# EAGLE design imu_2_xy (EAGLE 4.15)

## Sheet 1 of 2
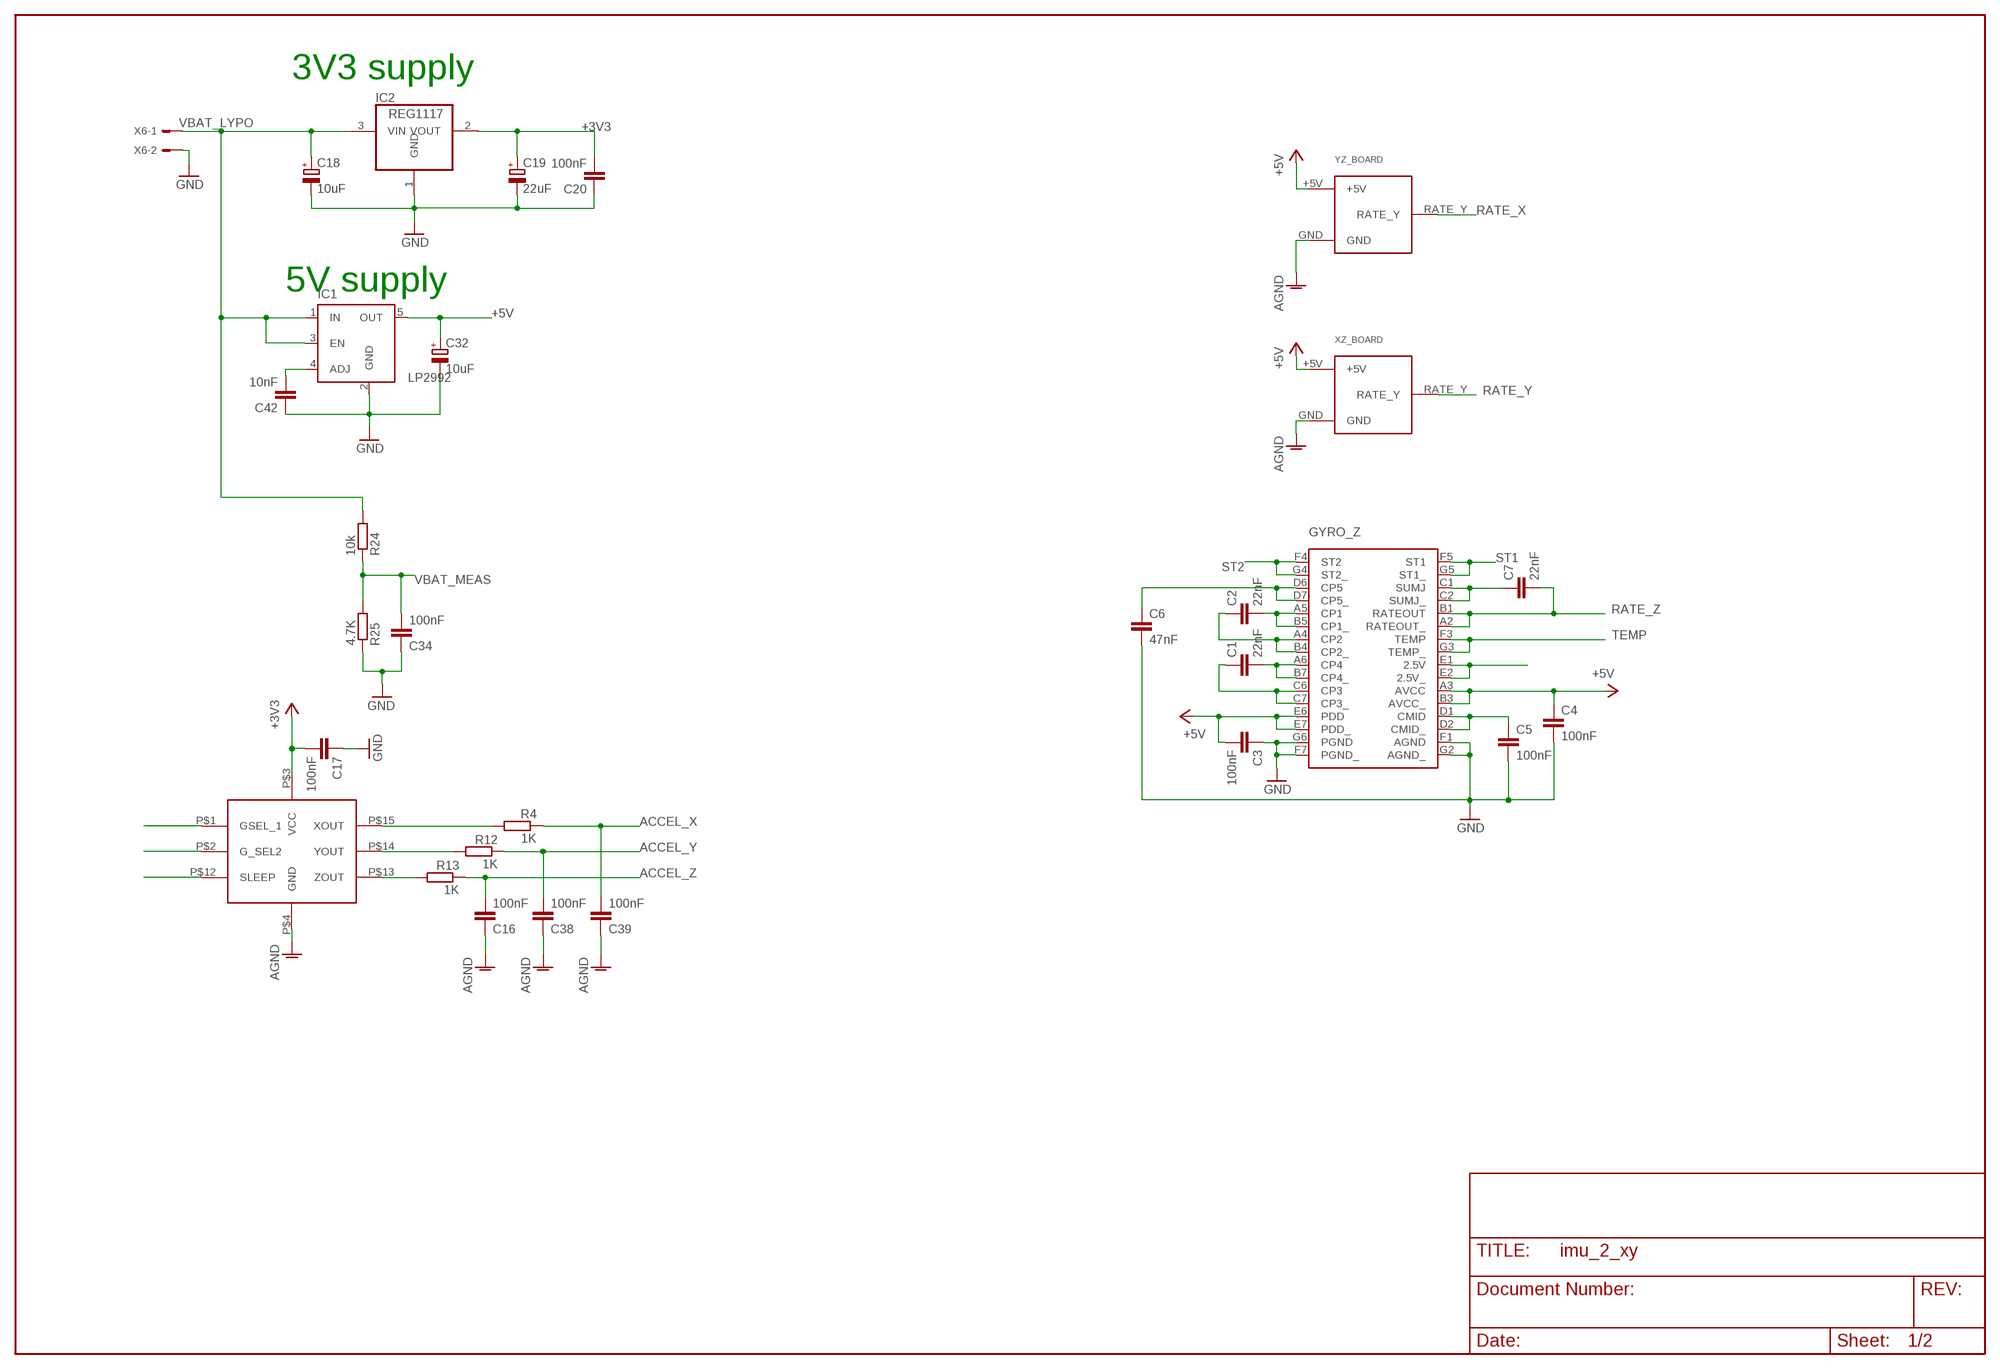
[diagram p0: schematic, sheet 1]

### Parts
C1  22nF  C-EUC0402K  [C0402K]
C2  22nF  C-EUC0402K  [C0402K]
C3  100nF  C-EUC0402K  [C0402K]
C4  100nF  C-EUC0402K  [C0402K]
C5  100nF  C-EUC0402K  [C0402K]
C6  47nF  C-EUC0402K  [C0402K]
C7  22nF  C-EUC0402K  [C0402K]
C16  100nF  C-EUC0402K  [C0402K]
C17  100nF  C-EUC0603K  [C0603K]
C18  10uF  CPOL-EUA/3216-18R  [A/3216-18R]
C19  22uF  CPOL-EUB/3528-21R  [B/3528-21R]
C20  100nF  C-EUC0603K  [C0603K]
C32  10uF  CPOL-EUA/3216-18R  [A/3216-18R]
C34  100nF  C-EUC0603K  [C0603K]
C38  100nF  C-EUC0603K  [C0603K]
C39  100nF  C-EUC0402K  [C0402K]
C42  10nF  C-EUC0603K  [C0603K]
GYRO_Z  ADXR  [BC-32]
IC1  LP2992  MIC5219BM5  [SOT23-5]
IC2  REG1117  [SOT223]
R4  1K  R-EU_R0402  [R0402]
R12  1K  R-EU_R0402  [R0402]
R13  1K  R-EU_R0402  [R0402]
R24  10k  R-EU_R0603  [R0603]
R25  4.7K  R-EU_R0603  [R0603]
U$5  MMA7260  [CASE162201]
X6  53048-02  [53048-02]
XZ_BOARD  IMU_XZ  [IMU_XZ]
YZ_BOARD  IMU_XZ  [IMU_XZ]

### Nets
+3V3: C17.2 C19.+ C20.2 IC2.2(VOUT) U$5.P$3(VCC) ; also sheet 2
+5V: C3.2 C4.1 C32.+ GYRO_Z.A3(AVCC) GYRO_Z.B3(AVCC_) GYRO_Z.E6(PDD) GYRO_Z.E7(PDD_) IC1.5(OUT) XZ_BOARD.+5V YZ_BOARD.+5V ; also sheet 2
ACCEL_X: C39.2 R4.1 ; also sheet 2
ACCEL_Y: C38.2 R12.1 ; also sheet 2
ACCEL_Z: C16.2 R13.1 ; also sheet 2
AGND: C16.1 C38.1 C39.1 U$5.P$4(GND) XZ_BOARD.GND YZ_BOARD.GND ; also sheet 2
GND: C3.1 C4.2 C5.2 C6.2 C17.1 C18.- C19.- C20.1 C32.- C34.1 C42.1 GYRO_Z.F1(AGND) GYRO_Z.F7(PGND_) GYRO_Z.G2(AGND_) GYRO_Z.G6(PGND) IC1.2(GND) IC2.1(GND) R25.1 X6.2 ; also sheet 2
N$1: C1.2 GYRO_Z.A6(CP4) GYRO_Z.B7(CP4_)
N$2: C1.1 GYRO_Z.C6(CP3) GYRO_Z.C7(CP3_)
N$3: C2.2 GYRO_Z.A5(CP1) GYRO_Z.B5(CP1_)
N$4: C2.1 GYRO_Z.A4(CP2) GYRO_Z.B4(CP2_)
N$5: GYRO_Z.E1(2.5V) GYRO_Z.E2(2.5V_)
N$6: R4.2 U$5.P$15(XOUT)
N$8: C7.1 GYRO_Z.C1(SUMJ) GYRO_Z.C2(SUMJ_)
N$9: C6.1 GYRO_Z.D6(CP5) GYRO_Z.D7(CP5_)
N$10: C5.1 GYRO_Z.D1(CMID) GYRO_Z.D2(CMID_)
N$11: R12.2 U$5.P$14(YOUT)
N$12: R13.2 U$5.P$13(ZOUT)
N$13: U$5.P$1(GSEL_1)
N$16: U$5.P$2(G_SEL2)
N$17: U$5.P$12(SLEEP)
N$23: C42.2 IC1.4(ADJ)
RATE_X: YZ_BOARD.RATE_Y ; also sheet 2
RATE_Y: XZ_BOARD.RATE_Y ; also sheet 2
RATE_Z: C7.2 GYRO_Z.A2(RATEOUT_) GYRO_Z.B1(RATEOUT) ; also sheet 2
ST1: GYRO_Z.F5(ST1) GYRO_Z.G5(ST1_)
ST2: GYRO_Z.F4(ST2) GYRO_Z.G4(ST2_)
TEMP: GYRO_Z.F3(TEMP) GYRO_Z.G3(TEMP_) ; also sheet 2
VBAT_LYPO: C18.+ IC1.1(IN) IC1.3(EN) IC2.3(VIN) R24.2 X6.1
VBAT_MEAS: C34.2 R24.1 R25.2

### Notes on the sheet
- 3V3 supply
- 5V supply

## Sheet 2 of 2
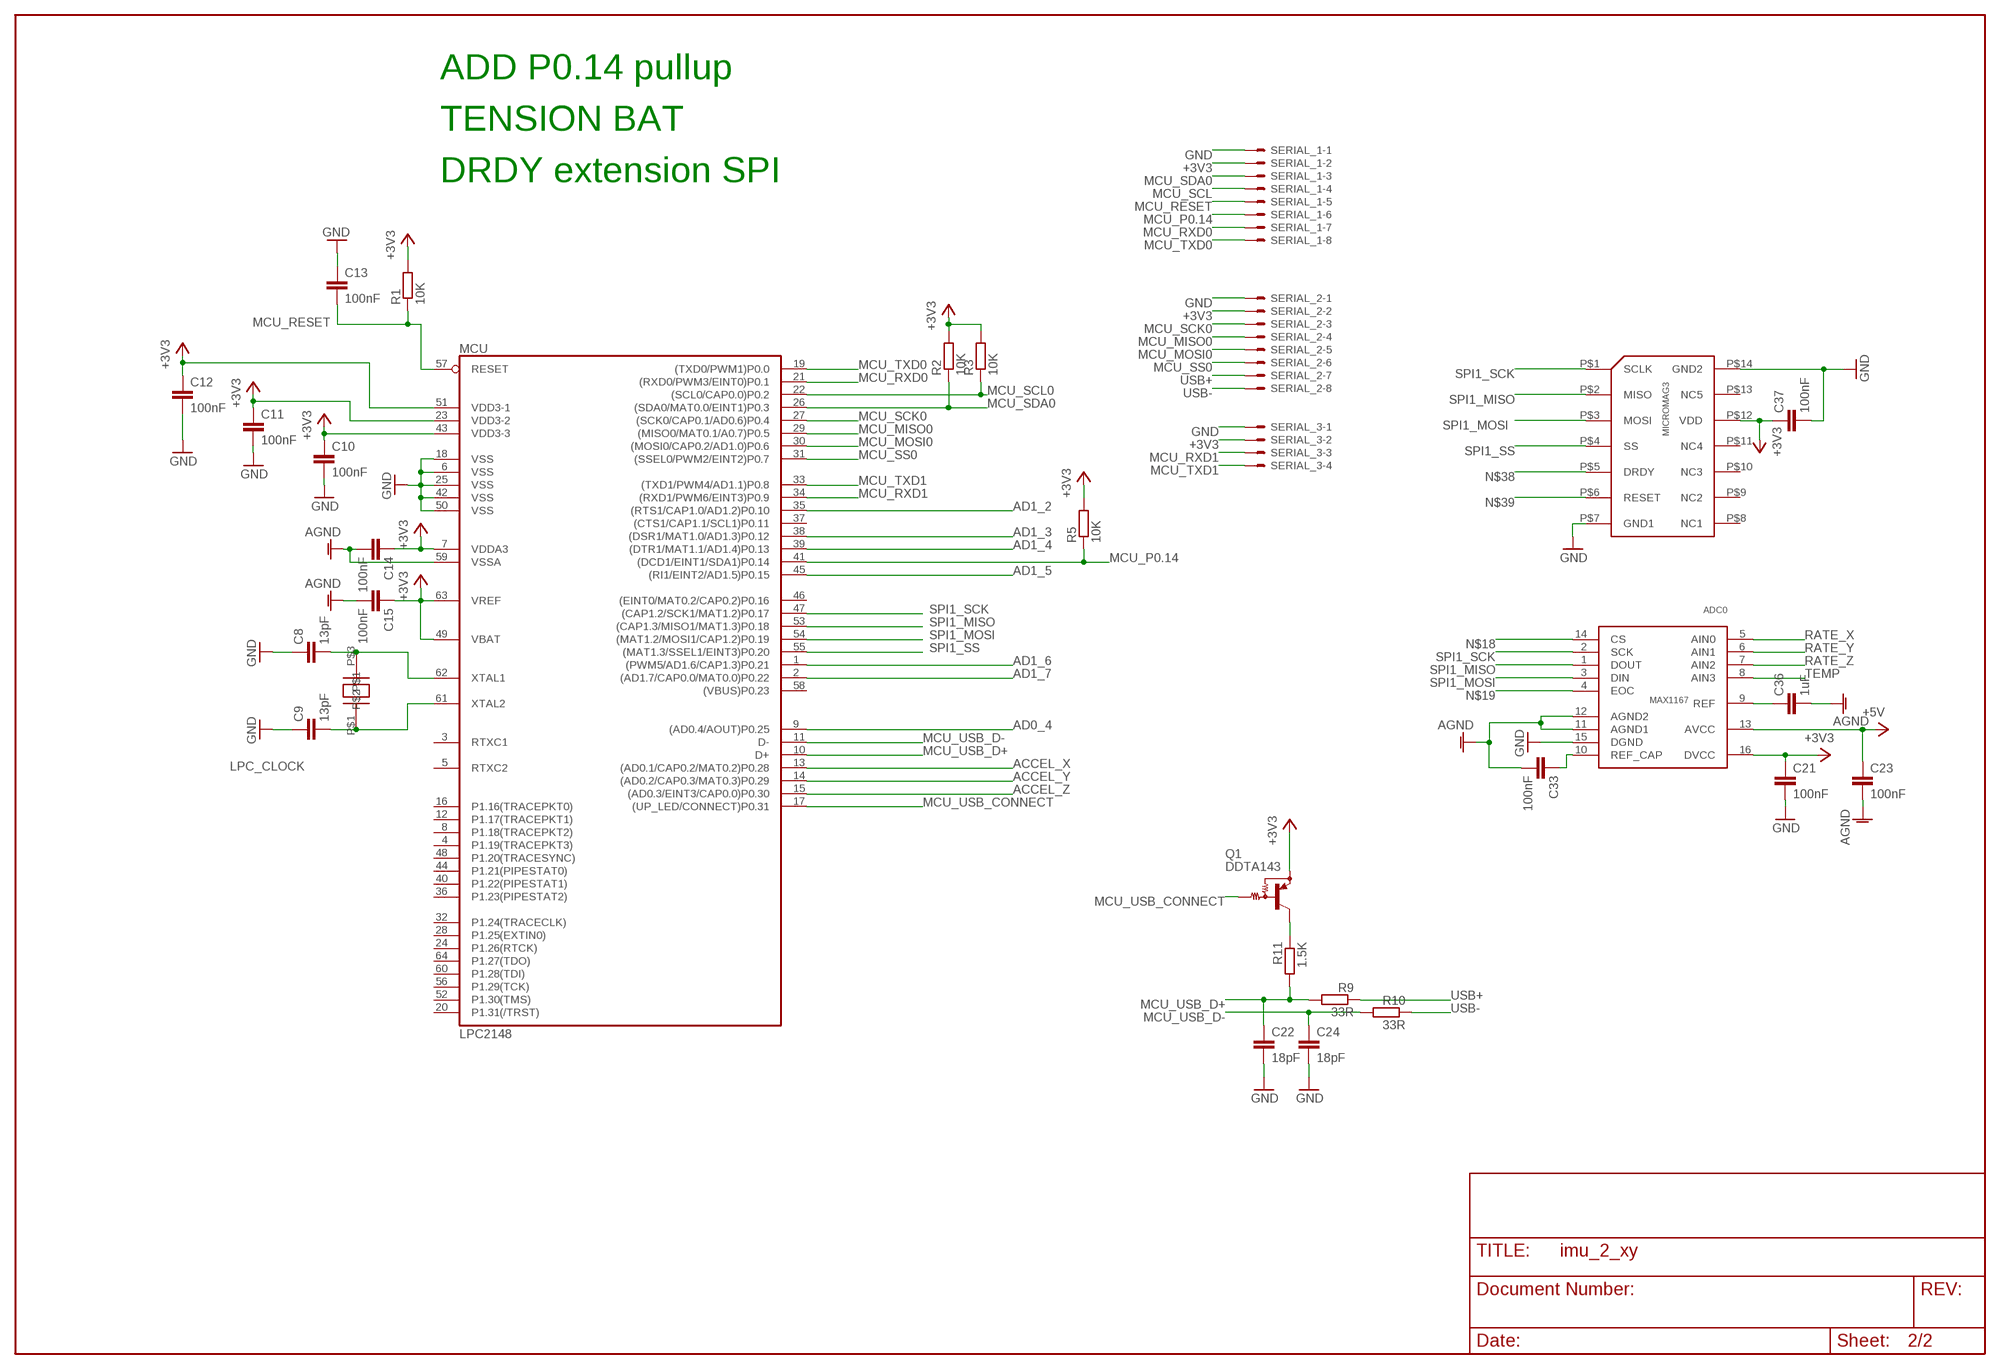
[diagram p1: schematic, sheet 2]

### Parts
ADC0  MAX1167  [QSOP16]
C8  13pF  C-EUC0402K  [C0402K]
C9  13pF  C-EUC0402K  [C0402K]
C10  100nF  C-EUC0402K  [C0402K]
C11  100nF  C-EUC0402K  [C0402K]
C12  100nF  C-EUC0402K  [C0402K]
C13  100nF  C-EUC0402K  [C0402K]
C14  100nF  C-EUC0402K  [C0402K]
C15  100nF  C-EUC0402K  [C0402K]
C21  100nF  C-EUC0402K  [C0402K]
C22  18pF  C-EUC0402K  [C0402K]
C23  100nF  C-EUC0402K  [C0402K]
C24  18pF  C-EUC0402K  [C0402K]
C33  100nF  C-EUC0402K  [C0402K]
C36  1uF  C-EUC0805  [C0805]
C37  100nF  C-EUC0402K  [C0402K]
MCU  LPC2148  [SQFP-S-10X10-64]
Q1  DDTA143  MUN2111T1  [SC59-BEC]
R1  10K  R-EU_R0402  [R0402]
R2  10K  R-EU_R0402  [R0402]
R3  10K  R-EU_R0402  [R0402]
R5  10K  R-EU_R0402  [R0402]
R9  33R  R-EU_R1005  [R1005]
R10  33R  R-EU_R1005  [R1005]
R11  1.5K  R-EU_R1005  [R1005]
SERIAL_1  53047-08  [53047-08]
SERIAL_2  53047-08  [53047-08]
SERIAL_3  53047-04  [53047-04]
U$3  14.764Mhz  CRYSTAL_CTS  [CTS_CRYSTAL]
U$9  MICROMAG3  [MICROMAG3]

### Nets
+3V3: ADC0.16(DVCC) C10.1 C11.1 C12.1 C14.1 C15.1 C21.1 C37.1 MCU.7(VDDA3) MCU.23(VDD3-2) MCU.43(VDD3-3) MCU.49(VBAT) MCU.51(VDD3-1) MCU.63(VREF) Q1.E R1.2 R2.2 R3.2 R5.2 SERIAL_1.2 SERIAL_2.2 SERIAL_3.2 U$9.P$12(VDD) ; also sheet 1
+5V: ADC0.13(AVCC) C23.1 ; also sheet 1
ACCEL_X: MCU.13((AD0.1/CAP0.2/MAT0.2)P0.28) ; also sheet 1
ACCEL_Y: MCU.14((AD0.2/CAP0.3/MAT0.3)P0.29) ; also sheet 1
ACCEL_Z: MCU.15((AD0.3/EINT3/CAP0.0)P0.30) ; also sheet 1
AD0_4: MCU.9((AD0.4/AOUT)P0.25)
AD1_2: MCU.35((RTS1/CAP1.0/AD1.2)P0.10)
AD1_3: MCU.38((DSR1/MAT1.0/AD1.3)P0.12)
AD1_4: MCU.39((DTR1/MAT1.1/AD1.4)P0.13)
AD1_5: MCU.45((RI1/EINT2/AD1.5)P0.15)
AD1_6: MCU.1((PWM5/AD1.6/CAP1.3)P0.21)
AD1_7: MCU.2((AD1.7/CAP0.0/MAT0.0)P0.22)
AGND: ADC0.11(AGND1) ADC0.12(AGND2) C14.2 C15.2 C23.2 C33.2 C36.2 MCU.59(VSSA) ; also sheet 1
GND: ADC0.15(DGND) C8.1 C9.1 C10.2 C11.2 C12.2 C13.1 C21.2 C22.2 C24.2 C37.2 MCU.6(VSS) MCU.18(VSS) MCU.25(VSS) MCU.42(VSS) MCU.50(VSS) SERIAL_1.1 SERIAL_2.1 SERIAL_3.1 U$9.P$7(GND1) U$9.P$14(GND2) ; also sheet 1
LPC_CLOCK: C9.2 MCU.61(XTAL2) U$3.P$1
MCU_MISO0: MCU.29((MISO0/MAT0.1/A0.7)P0.5) SERIAL_2.4
MCU_MOSI0: MCU.30((MOSI0/CAP0.2/AD1.0)P0.6) SERIAL_2.5
MCU_P0.14: MCU.41((DCD1/EINT1/SDA1)P0.14) R5.1 SERIAL_1.6
MCU_RESET: C13.2 MCU.57(RESET) R1.1 SERIAL_1.5
MCU_RXD0: MCU.21((RXD0/PWM3/EINT0)P0.1) SERIAL_1.7
MCU_RXD1: MCU.34((RXD1/PWM6/EINT3)P0.9) SERIAL_3.3
MCU_SCK0: MCU.27((SCK0/CAP0.1/AD0.6)P0.4) SERIAL_2.3
MCU_SCL: SERIAL_1.4
MCU_SCL0: MCU.22((SCL0/CAP0.0)P0.2) R3.1
MCU_SDA0: MCU.26((SDA0/MAT0.0/EINT1)P0.3) R2.1 SERIAL_1.3
MCU_SS0: MCU.31((SSEL0/PWM2/EINT2)P0.7) SERIAL_2.6
MCU_TXD0: MCU.19((TXD0/PWM1)P0.0) SERIAL_1.8
MCU_TXD1: MCU.33((TXD1/PWM4/AD1.1)P0.8) SERIAL_3.4
MCU_USB_CONNECT: MCU.17((UP_LED/CONNECT)P0.31) Q1.B
MCU_USB_D+: C22.1 MCU.10(D+) R9.2 R11.2
MCU_USB_D-: C24.1 MCU.11(D-) R10.2
N$7: C8.2 MCU.62(XTAL1) U$3.P$3
N$14: Q1.C R11.1
N$18: ADC0.14(CS)
N$19: ADC0.4(EOC)
N$20: ADC0.10(REF_CAP) C33.1
N$21: ADC0.9(REF) C36.1
N$38: U$9.P$5(DRDY)
N$39: U$9.P$6(RESET)
RATE_X: ADC0.5(AIN0) ; also sheet 1
RATE_Y: ADC0.6(AIN1) ; also sheet 1
RATE_Z: ADC0.7(AIN2) ; also sheet 1
SPI1_MISO: ADC0.1(DOUT) MCU.53((CAP1.3/MISO1/MAT1.3)P0.18) U$9.P$2(MISO)
SPI1_MOSI: ADC0.3(DIN) MCU.54((MAT1.2/MOSI1/CAP1.2)P0.19) U$9.P$3(MOSI)
SPI1_SCK: ADC0.2(SCK) MCU.47((CAP1.2/SCK1/MAT1.2)P0.17) U$9.P$1(SCLK)
SPI1_SS: MCU.55((MAT1.3/SSEL1/EINT3)P0.20) U$9.P$4(SS)
TEMP: ADC0.8(AIN3) ; also sheet 1
USB+: R9.1 SERIAL_2.7
USB-: R10.1 SERIAL_2.8
Unconnected: MCU.3(RTXC1) MCU.4(P1.19(TRACEPKT3)) MCU.5(RTXC2) MCU.8(P1.18(TRACEPKT2)) MCU.12(P1.17(TRACEPKT1)) MCU.16(P1.16(TRACEPKT0)) MCU.20(P1.31(/TRST)) MCU.24(P1.26(RTCK)) MCU.28(P1.25(EXTIN0)) MCU.32(P1.24(TRACECLK)) MCU.36(P1.23(PIPESTAT2)) MCU.37((CTS1/CAP1.1/SCL1)P0.11) MCU.40(P1.22(PIPESTAT1)) MCU.44(P1.21(PIPESTAT0)) MCU.46((EINT0/MAT0.2/CAP0.2)P0.16) MCU.48(P1.20(TRACESYNC)) MCU.52(P1.30(TMS)) MCU.56(P1.29(TCK)) MCU.58((VBUS)P0.23) MCU.60(P1.28(TDI)) MCU.64(P1.27(TDO)) U$9.P$8(NC1) U$9.P$9(NC2) U$9.P$10(NC3) U$9.P$11(NC4) U$9.P$13(NC5)

### Notes on the sheet
- ADD P0.14 pullup
- TENSION BAT
- DRDY extension SPI

## Library data of the parts
ADC0 = paparazzi:MAX1167: 16 bits 4 channel ADC
C1-C17 C20-C24 C33 C34 C36-C39 C42 = rcl:C-EU: CAPACITOR, European symbol
C18 C19 C32 = rcl:CPOL-EU: POLARIZED CAPACITOR, European symbol
GYRO_Z = paparazzi:ADXR
IC1 = v-reg-micrel:MIC5219BM5: VOLTAGE REGULATOR
IC2 = burr-brown:REG1117: 800mA and 1A Low Dropout (LDO) Positive Regulator 1.8V, 2.5V, 2.85V, 3.3V, 5V, and Adj
MCU = paparazzi:LPC2148
Q1 = transistor-pnp:MUN2111*: PNP Bias Resistor Transistor
R1-R5 R9-R13 R24 R25 = rcl:R-EU_: RESISTOR, European symbol
SERIAL_1 SERIAL_2 = con-molex:53?-08: CONNECTOR wire to board 1.25 mm (.049 inch) pitch header
SERIAL_3 = con-molex:53?-04: CONNECTOR wire to board 1.25 mm (.049 inch) pitch header
U$3 = paparazzi:CRYSTAL_CTS
U$5 = paparazzi:MMA7260
U$9 = paparazzi:MICROMAG3
X6 = con-molex:53?-02: CONNECTOR wire to board 1.25 mm (.049 inch) pitch header
XZ_BOARD YZ_BOARD = paparazzi:IMU_XZ

## Board
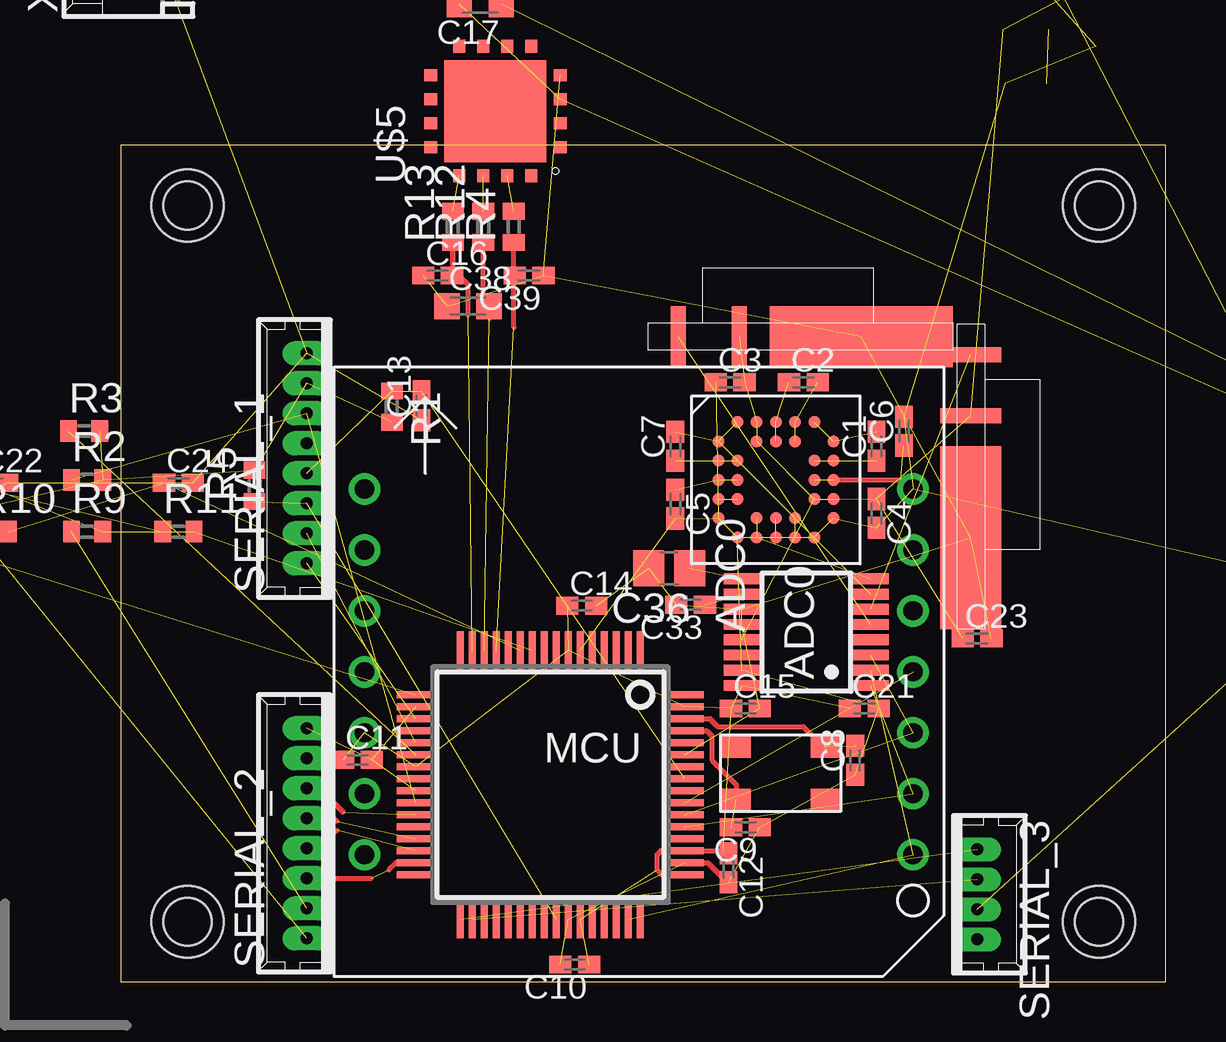
[diagram p2: board, top side]
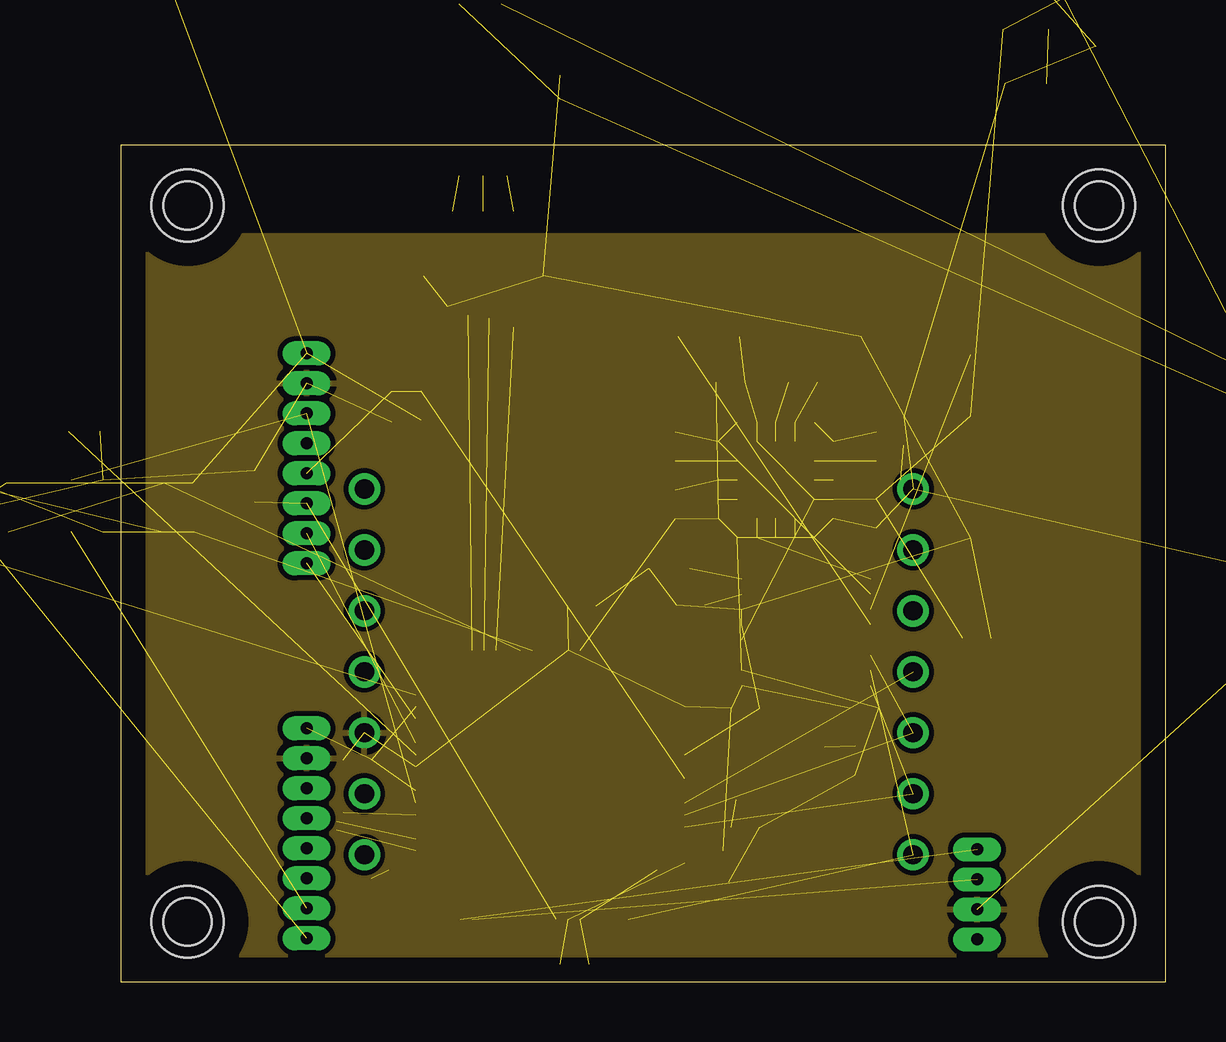
[diagram p3: board, inner layer $Route2]
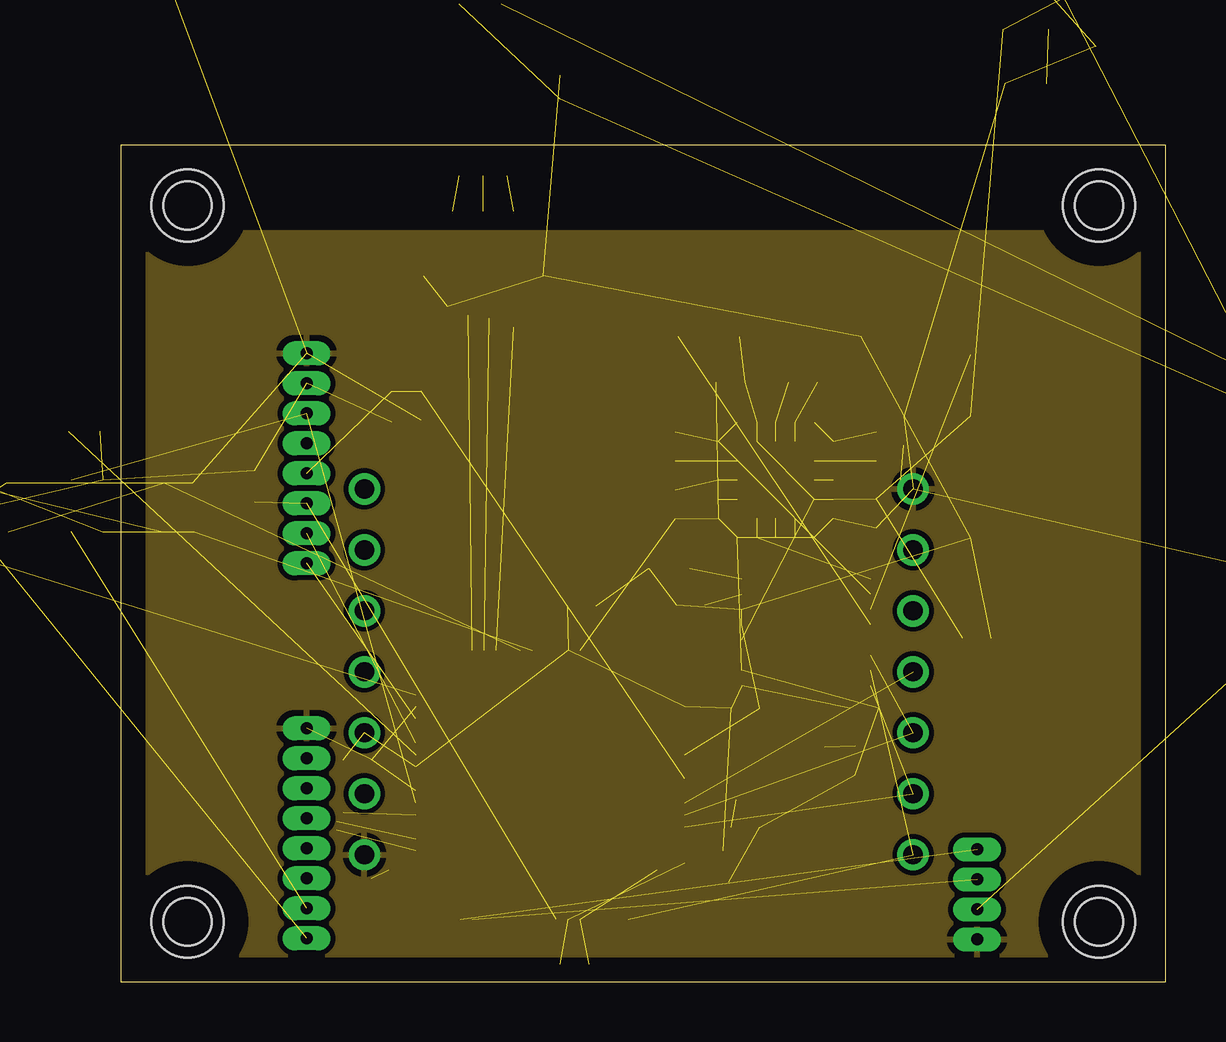
[diagram p4: board, inner layer $Route15]
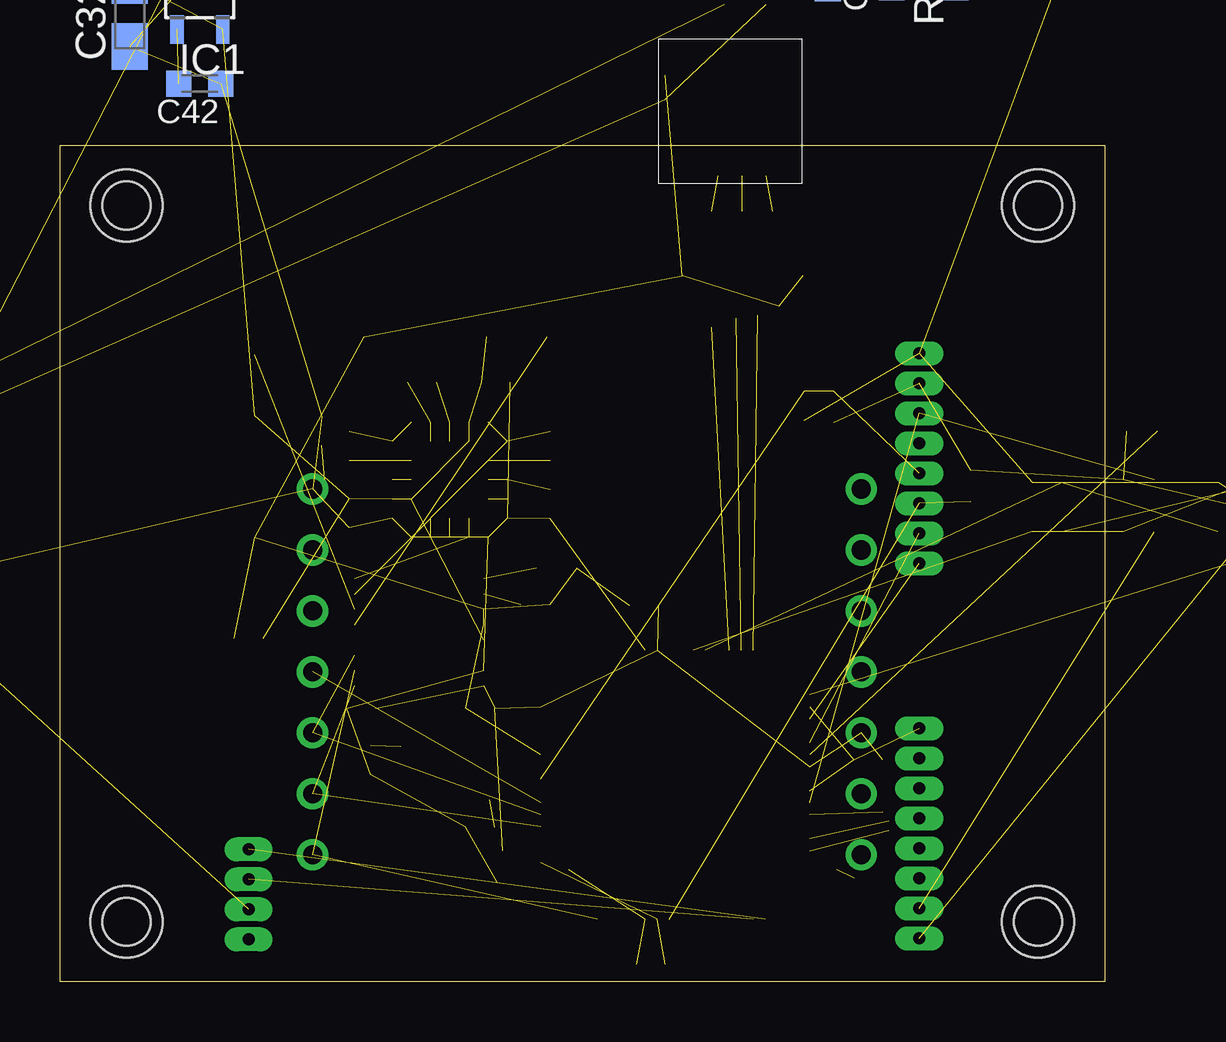
[diagram p5: board, bottom side, seen from below]

Size 43.54 x 34.85 mm. Coordinates in mm from the lower left corner, seen from the top.
Outline: 0,0 43.54,0 43.54,34.85 0,34.85 0,0
Copper layers (1*16): Top 0.035mm / dielectric 1.5mm / Bottom 0.035mm
Design rules "eurocircuits_europrint": minimum track width 0.2mm, minimum drill 0.35mm, track to track 0.2mm, track to pad 0.2mm, pad to pad 0.2mm, via to via 0.2mm, smd to smd 0.2mm, copper to edge 40mil, drill to drill 8mil, minimum pad ring 10mil, minimum via ring 5mil, stop-mask expansion 4mil, vias tented up to drill 0mil, thermal gap 10mil
Holes 2 mm at 40.76,32.35 40.76,2.5 2.79,32.35 2.79,2.5
Holes 3 mm at 2.79,32.35 2.79,2.5 40.76,32.35 40.76,2.5

### Footprints (pad centres in the part's own frame; a part is rotated, then mirrored left to right if it is on the bottom)
QSOP16 = smd 0.45 x 1.5: 1 -2.223,-2.69; 2 -1.587,-2.69; 3 -0.953,-2.69; 4 -0.318,-2.69; 5 0.318,-2.69; 6 0.953,-2.69; 7 1.587,-2.69; 8 2.223,-2.69; 9 2.223,2.69; 10 1.587,2.69; 11 0.953,2.69; 12 0.318,2.69; 13 -0.318,2.69; 14 -0.953,2.69; 15 -1.587,2.69; 16 -2.223,2.69
C0402K = smd 0.925 x 0.74: 1 -0.6,0; 2 0.6,0
C0603K = smd 1.05 x 1.08: 1 -0.875,0; 2 0.875,0
A/3216-18R = smd 1.95 x 1.5: + 1.375,0; - -1.375,0
B/3528-21R = smd 1.95 x 2.5: + 1.525,0; - -1.525,0
C0805 = smd 1.3 x 1.5: 1 -0.85,0; 2 0.85,0
BC-32 = smd 0.5 x 0.5: A2 -1.6,2.4; A3 -0.8,2.4; A4 0,2.4; A5 0.8,2.4; A6 1.6,2.4; B1 -2.4,1.6; B3 -0.8,1.6; B4 0,1.6; B5 0.8,1.6; B7 2.4,1.6; C1 -2.4,0.8; C2 -1.6,0.8; C6 1.6,0.8; C7 2.4,0.8; D1 -2.4,0; D2 -1.6,0; D6 1.6,0; D7 2.4,0; E1 -2.4,-0.8; E2 -1.6,-0.8; E6 1.6,-0.8; E7 2.4,-0.8; F1 -2.4,-1.6; F3 -0.8,-1.6; F4 0,-1.6; F5 0.8,-1.6; F7 2.4,-1.6; G2 -1.6,-2.4; G3 -0.8,-2.4; G4 0,-2.4; G5 0.8,-2.4; G6 1.6,-2.4
SOT23-5 = smd 0.55 x 1.2: 1 -0.95,-1.3; 2 0,-1.3; 3 0.95,-1.3; 4 0.95,1.3; 5 -0.95,1.3
SOT223 = smd 1.499 x 2.007: 1 -2.261,-3.15; 2 0.025,-3.15; 3 2.311,-3.15 | smd 3.81 x 2.007: 4 0,3.15
SQFP-S-10X10-64 = smd 0.3 x 1.6: 1 -3.75,-5.6; 2 -3.25,-5.6; 3 -2.75,-5.6; 4 -2.25,-5.6; 5 -1.75,-5.6; 6 -1.25,-5.6; 7 -0.75,-5.6; 8 -0.25,-5.6; 9 0.25,-5.6; 10 0.75,-5.6; 11 1.25,-5.6; 12 1.75,-5.6; 13 2.25,-5.6; 14 2.75,-5.6; 15 3.25,-5.6; 16 3.75,-5.6; 33 3.75,5.6; 34 3.25,5.6; 35 2.75,5.6; 36 2.25,5.6; 37 1.75,5.6; 38 1.25,5.6; 39 0.75,5.6; 40 0.25,5.6; 41 -0.25,5.6; 42 -0.75,5.6; 43 -1.25,5.6; 44 -1.75,5.6; 45 -2.25,5.6; 46 -2.75,5.6; 47 -3.25,5.6; 48 -3.75,5.6 | smd 1.6 x 0.3: 17 5.6,-3.75; 18 5.6,-3.25; 19 5.6,-2.75; 20 5.6,-2.25; 21 5.6,-1.75; 22 5.6,-1.25; 23 5.6,-0.75; 24 5.6,-0.25; 25 5.6,0.25; 26 5.6,0.75; 27 5.6,1.25; 28 5.6,1.75; 29 5.6,2.25; 30 5.6,2.75; 31 5.6,3.25; 32 5.6,3.75; 49 -5.6,3.75; 50 -5.6,3.25; 51 -5.6,2.75; 52 -5.6,2.25; 53 -5.6,1.75; 54 -5.6,1.25; 55 -5.6,0.75; 56 -5.6,0.25; 57 -5.6,-0.25; 58 -5.6,-0.75; 59 -5.6,-1.25; 60 -5.6,-1.75; 61 -5.6,-2.25; 62 -5.6,-2.75; 63 -5.6,-3.25; 64 -5.6,-3.75
SC59-BEC = smd 1 x 1.4: B -0.95,-1.2; C 0,1.2; E 0.95,-1.2
R0402 = smd 0.7 x 0.9: 1 -0.65,0; 2 0.65,0
R1005 = smd 0.7 x 0.9: 1 -0.65,0; 2 0.65,0
R0603 = smd 1 x 1.1: 1 -0.85,0; 2 0.85,0
53047-08 = drill 0.5 pad 0.698 long: 1 4.375,0; 2 3.125,0; 3 1.875,0; 4 0.625,0; 5 -0.625,0; 6 -1.875,0; 7 -3.125,0; 8 -4.375,0
53047-04 = drill 0.5 pad 0.698 long: 1 1.875,0; 2 0.625,0; 3 -0.625,0; 4 -1.875,0
CTS_CRYSTAL = smd 1.2 x 0.9: P$1 -1.85,-1.1; P$2 1.85,-1.1; P$3 1.85,1.1; P$4 -1.85,1.1
CASE162201 = smd 0.5 x 0.55: P$1 -1.5,-2.7; P$2 -0.5,-2.7; P$3 0.5,-2.7; P$4 1.5,-2.7; P$9 1.5,2.7; P$10 0.5,2.7; P$11 -0.5,2.7; P$12 -1.5,2.7 | smd 0.55 x 0.5: P$5 2.7,-1.5; P$6 2.7,-0.5; P$7 2.7,0.5; P$8 2.7,1.5; P$13 -2.7,1.5; P$14 -2.7,0.5; P$15 -2.7,-0.5; P$16 -2.7,-1.5 | smd 4.25 x 4.25: P$17 0,0
MICROMAG3 = drill 0.8 round: P$1 -7.62,-11.43; P$2 -5.08,-11.43; P$3 -2.54,-11.43; P$4 0,-11.43; P$5 2.54,-11.43; P$6 5.08,-11.43; P$7 7.62,-11.43; P$8 7.62,11.43; P$9 5.08,11.43; P$10 2.54,11.43; P$11 0,11.43; P$12 -2.54,11.43; P$13 -5.08,11.43; P$14 -7.62,11.43
53048-02 = drill 0.5 pad 0.698 long: 1 0.625,-1.25; 2 -0.625,-1.25
IMU_XZ = smd 0.635 x 2.54: +5V -2.54,0; RATE_Y -5.08,0 | smd 7.62 x 2.54: GND 2.54,0

### Placement (x,y rotation side)
ADC0  28.57,14.57 90 top
C1  31.49,22.31 90 top
C2  28.44,24.98 0 top
C3  25.39,24.98 0 top
C4  31.49,19.52 270 top
C5  23.11,19.9 270 top
C6  32.63,22.95 90 top
C7  23.11,22.31 90 top
C8  30.6,9.23 90 top
C9  26.03,6.44 180 top
C10  18.92,0.72 180 top
C11  9.86,9.25 0 top
C12  25.33,4.75 270 top
C13  12.53,24 90 top
C14  19.21,15.67 0 top
C15  26.03,11.39 0 top
C16  13.2,29.43 0 top
C17  14.98,40.73 180 top  (outside the outline)
C18  47.75,18.5 90 bottom  (outside the outline)
C19  51.68,19.27 0 bottom  (outside the outline)
C20  51.68,16.73 0 bottom  (outside the outline)
C21  30.98,11.39 0 top
C22  -5.34,20.79 0 top  (outside the outline)
C23  35.68,14.31 0 top
C24  2.41,20.79 0 top
C32  40.63,40.35 90 bottom  (outside the outline)
C33  23.74,15.71 180 top
C34  11.55,42.25 270 bottom  (outside the outline)
C36  22.86,17.23 180 top
C37  -10.16,16.85 180 top  (outside the outline)
C38  14.47,28.16 0 top
C39  17.01,29.43 180 top
C42  37.71,37.43 180 bottom
GYRO_Z  27.3,20.92 0 top
IC1  37.71,40.98 180 bottom  (outside the outline)
IC2  51.3,25.36 0 bottom  (outside the outline)
MCU  17.9,8.22 180 top
Q1  -9.53,20.28 0 top  (outside the outline)
R1  11.3,23.96 270 top
R2  -1.4,20.92 0 top
R3  -1.53,22.95 0 top
R4  16.38,31.46 90 top
R5  5.58,20.66 90 top
R9  -1.4,18.76 0 top
R10  -5.34,18.76 0 top  (outside the outline)
R11  2.41,18.76 0 top
R12  15.11,31.46 90 top
R13  13.84,31.46 90 top
R24  6.22,42.25 90 bottom  (outside the outline)
R25  8.89,42.25 270 bottom  (outside the outline)
SERIAL_1  7.74,21.81 90 top
SERIAL_2  7.74,6.18 90 top
SERIAL_3  35.68,3.64 270 top
U$3  27.49,8.69 0 top
U$5  15.62,36.28 90 top
U$9  21.58,12.92 90 top
X6  0.76,42.25 90 top  (outside the outline)
XZ_BOARD  35.43,21.04 270 top
YZ_BOARD  28.32,26.89 0 top

### Tracks (layer width: path | path; a pad name or v marks a point on that pad's centre or on a via)
+3V3  (22 unrouted)
  Top 0.203: MCU.49 22.54,4.47 22.35,4.66 22.35,5.3 22.52,5.47 MCU.51 25.1,5.47 25.27,5.3 C12.1
  pour $Route2: 51.3,31.08 0.25,31.08 0.25,0.34 51.3,0.34
+5V  (11 unrouted)
ACCEL_X  (1 unrouted)
  Top 0.203: 16.38,29.43 R4.1 | 16.38,29.43 C39.2 | 16.38,27.27 16.38,29.43
ACCEL_Y  (1 unrouted)
  Top 0.203: R12.1 15.11,28.66 15.36,28.41 | C38.2 15.36,28.41 | 15.36,28.41 15.36,27.65
ACCEL_Z  (1 unrouted)
  Top 0.203: C16.2 13.84,29.43 R13.1 13.84,29.68 14.47,29.04 14.47,27.77
AGND  (13 unrouted)
GND  (34 unrouted)
  Top 0.203: C12.2 25.27,4.15 24.45,4.97 MCU.50
  pour $Route15: 51.3,31.2 0.25,31.2 0.25,0.34 51.3,0.34
LPC_CLOCK  (1 unrouted)
  Top 0.203: MCU.61 24.42,10.47 24.63,10.25 24.63,9.23 25.65,8.22 U$3.P$1
MCU_MISO0  (1 unrouted)
  Top 0.203: 9.01,6.69 8.89,6.82 SERIAL_2.4
MCU_MOSI0  (1 unrouted)
  Top 0.203: SERIAL_2.5 8.24,5.56 8.25,5.55 9.01,6.31
MCU_P0.14  (2 unrouted)
MCU_RESET  (3 unrouted)
MCU_RXD0  (1 unrouted)
MCU_RXD1  (1 unrouted)
MCU_SCK0  (1 unrouted)
  Top 0.203: SERIAL_2.3 8.28,8.06 9.27,7.07
MCU_SCL0  (1 unrouted)
MCU_SDA0  (2 unrouted)
MCU_SS0  (1 unrouted)
  Top 0.203: MCU.31 11.48,4.97 11.17,4.66 | SERIAL_2.6 10.44,4.31
MCU_TXD0  (1 unrouted)
MCU_TXD1  (1 unrouted)
MCU_USB_CONNECT  (1 unrouted)
MCU_USB_D+  (3 unrouted)
MCU_USB_D-  (2 unrouted)
N$1  (2 unrouted)
N$2  (2 unrouted)
N$3  (2 unrouted)
N$4  (2 unrouted)
N$5  (1 unrouted)
N$6  (1 unrouted)
N$7  (1 unrouted)
  Top 0.203: MCU.62 24.55,10.97 24.89,10.63 28.44,10.63 29.33,9.74 29.35,9.75 U$3.P$3
N$8  (2 unrouted)
N$9  (2 unrouted)
  Top 0.203: GYRO_Z.D7 32.51,20.92
N$10  (2 unrouted)
N$11  (1 unrouted)
N$12  (1 unrouted)
N$14  (1 unrouted)
N$20  (1 unrouted)
N$21  (1 unrouted)
N$23  (1 unrouted)
RATE_X  (1 unrouted)
RATE_Y  (1 unrouted)
RATE_Z  (3 unrouted)
SPI1_MISO  (2 unrouted)
SPI1_MOSI  (2 unrouted)
SPI1_SCK  (2 unrouted)
SPI1_SS  (1 unrouted)
ST1  (1 unrouted)
ST2  (1 unrouted)
TEMP  (2 unrouted)
USB+  (1 unrouted)
USB-  (1 unrouted)
VBAT_LYPO  (5 unrouted)
VBAT_MEAS  (2 unrouted)

### Text on the board
tDocu: Y | X